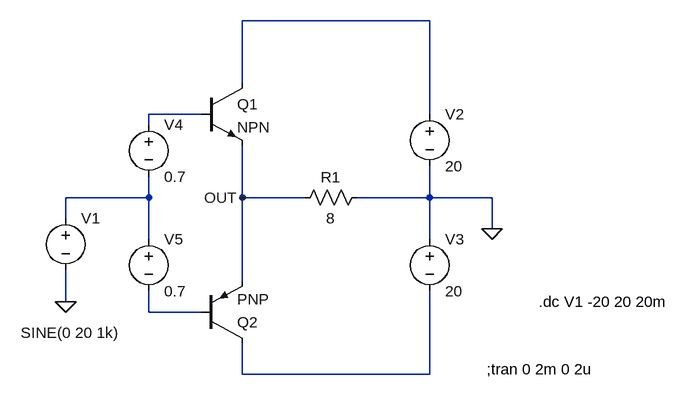
[diagram p0: schematic 11kadai1.asc]
11kadai1.asc, the LTspice schematic file:
Version 4
SHEET 1 1020 680
WIRE 640 96 352 96
WIRE 352 192 352 96
WIRE 288 240 208 240
WIRE 640 240 640 96
WIRE 208 256 208 240
WIRE 208 368 208 336
WIRE 208 368 80 368
WIRE 352 368 352 288
WIRE 448 368 352 368
WIRE 640 368 640 320
WIRE 640 368 528 368
WIRE 736 368 640 368
WIRE 80 400 80 368
WIRE 736 416 736 368
WIRE 208 432 208 368
WIRE 640 432 640 368
WIRE 352 496 352 368
WIRE 80 528 80 480
WIRE 208 544 208 512
WIRE 288 544 208 544
WIRE 352 640 352 592
WIRE 640 640 640 512
WIRE 640 640 352 640
FLAG 736 416 0
FLAG 80 528 0
FLAG 352 368 OUT
SYMBOL npn 288 192 R0
SYMATTR InstName Q1
SYMBOL pnp 288 592 M180
SYMATTR InstName Q2
SYMBOL voltage 80 384 R0
WINDOW 3 -69 192 Left 2
SYMATTR Value SINE(0 20 1k)
SYMATTR InstName V1
SYMBOL voltage 640 224 R0
SYMATTR InstName V2
SYMATTR Value 20
SYMBOL voltage 640 416 R0
SYMATTR InstName V3
SYMATTR Value 20
SYMBOL res 544 352 R90
WINDOW 0 0 56 VBottom 2
WINDOW 3 32 56 VTop 2
SYMATTR InstName R1
SYMATTR Value 8
SYMBOL voltage 208 240 R0
SYMATTR InstName V4
SYMATTR Value 0.7
SYMBOL voltage 208 416 R0
SYMATTR InstName V5
SYMATTR Value 0.7
TEXT 728 632 Left 2 !;tran 0 2m 0 2u
TEXT 808 528 Left 2 !.dc V1 -20 20 20m

The netlist it stands for:
* 11kadai1.asc
Q1 N001 N002 OUT 0 NPN
Q2 N005 N004 OUT 0 PNP
V1 N003 0 SINE(0 20 1k)
V2 N001 0 20
V3 0 N005 20
R1 0 OUT 8
V4 N002 N003 0.7
V5 N003 N004 0.7
.model NPN NPN
.model PNP PNP
.lib standard.bjt
;tran 0 2m 0 2u
.dc V1 -20 20 20m
.backanno
.end